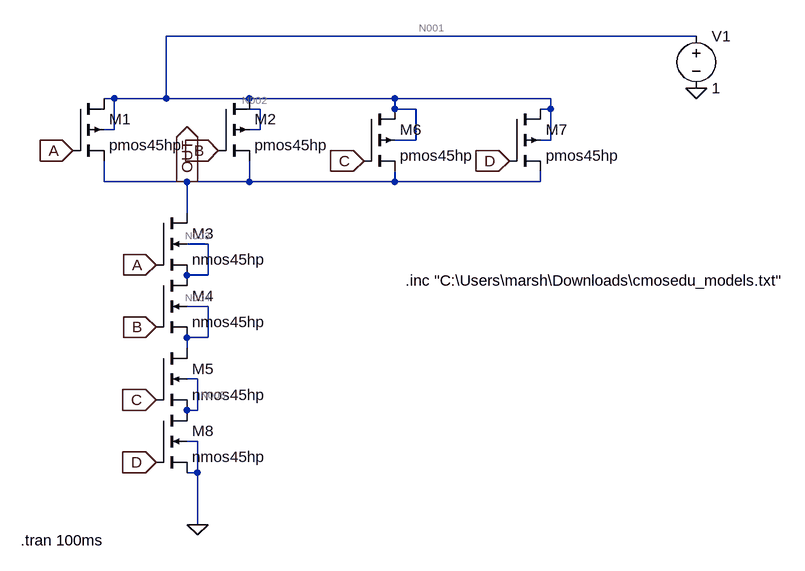
[diagram p0: schematic 4innand1.asc]
4innand1.asc, the LTspice schematic file:
Version 4.1
SHEET 1 1280 824
WIRE 1072 -32 256 -32
WIRE 176 64 160 64
WIRE 256 64 256 -32
WIRE 256 64 176 64
WIRE 384 64 256 64
WIRE 608 64 384 64
WIRE 848 64 608 64
WIRE 400 80 384 80
WIRE 608 80 608 64
WIRE 640 80 608 80
WIRE 848 80 848 64
WIRE 848 80 832 80
WIRE 176 112 176 64
WIRE 176 112 160 112
WIRE 400 112 400 80
WIRE 400 112 384 112
WIRE 640 128 640 80
WIRE 640 128 608 128
WIRE 848 128 848 80
WIRE 848 128 832 128
WIRE 160 192 160 160
WIRE 288 192 160 192
WIRE 384 192 384 160
WIRE 384 192 288 192
WIRE 608 192 608 176
WIRE 608 192 384 192
WIRE 832 192 832 176
WIRE 832 192 608 192
WIRE 288 240 288 192
WIRE 320 288 288 288
WIRE 320 336 320 288
WIRE 320 336 288 336
WIRE 320 384 288 384
WIRE 320 432 320 384
WIRE 320 432 288 432
WIRE 288 448 288 432
WIRE 304 496 288 496
WIRE 304 544 304 496
WIRE 304 544 288 544
WIRE 304 592 288 592
WIRE 304 640 304 592
WIRE 304 640 288 640
WIRE 304 720 304 640
FLAG 112 144 A
IOPIN 112 144 In
FLAG 240 320 A
IOPIN 240 320 In
FLAG 336 144 B
IOPIN 336 144 In
FLAG 240 416 B
IOPIN 240 416 In
FLAG 288 192 OUT
IOPIN 288 192 Out
FLAG 560 160 C
IOPIN 560 160 In
FLAG 240 528 C
IOPIN 240 528 In
FLAG 784 160 D
IOPIN 784 160 In
FLAG 240 624 D
IOPIN 240 624 In
FLAG 1072 48 0
FLAG 304 720 0
SYMBOL pmos4 112 64 R0
SYMATTR InstName M1
SYMATTR Value pmos45hp
SYMATTR Value2 l=100n w=300n
SYMBOL pmos4 336 64 R0
SYMATTR InstName M2
SYMATTR Value pmos45hp
SYMATTR Value2 l=100n w=300n
SYMBOL nmos4 240 240 R0
SYMATTR InstName M3
SYMATTR Value nmos45hp
SYMATTR Value2 l=100n w=800n
SYMBOL nmos4 240 336 R0
SYMATTR InstName M4
SYMATTR Value nmos45hp
SYMATTR Value2 l=100n w=800n
SYMBOL nmos4 240 448 R0
SYMATTR InstName M5
SYMATTR Value nmos45hp
SYMATTR Value2 l=100n w=800n
SYMBOL pmos4 560 80 R0
SYMATTR InstName M6
SYMATTR Value pmos45hp
SYMATTR Value2 l=100n w=300n
SYMBOL pmos4 784 80 R0
SYMATTR InstName M7
SYMATTR Value pmos45hp
SYMATTR Value2 l=100n w=300n
SYMBOL nmos4 240 544 R0
SYMATTR InstName M8
SYMATTR Value nmos45hp
SYMATTR Value2 l=100n w=800n
SYMBOL voltage 1072 -48 R0
WINDOW 123 0 0 Left 0
WINDOW 39 0 0 Left 0
SYMATTR InstName V1
SYMATTR Value 1
TEXT 624 344 Left 2 !.inc "C:\\Users\\marsh\\Downloads\\cmosedu_models.txt"
TEXT 32 744 Left 2 !.tran 100ms

The netlist it stands for:
* 4innand1.asc
M1 N001 A OUT N001 pmos45hp l=100n w=300n
M2 N001 B OUT N002 pmos45hp l=100n w=300n
M3 OUT A N003 N003 nmos45hp l=100n w=800n
M4 N003 B N004 N004 nmos45hp l=100n w=800n
M5 N004 C N005 N005 nmos45hp l=100n w=800n
M6 N001 C OUT N001 pmos45hp l=100n w=300n
M7 N001 D OUT N001 pmos45hp l=100n w=300n
M8 N005 D 0 0 nmos45hp l=100n w=800n
V1 N001 0 1
.model NMOS NMOS
.model PMOS PMOS
.lib standard.mos
.inc "C:\Users\marsh\Downloads\cmosedu_models.txt"
.tran 100ms
.backanno
.end

* Results of the author's LTspice run, read from the files saved beside the schematic
* Operating Point, zero values left out:
*   V(a) = 515.8 mV
*   V(b) = 505.8 mV
*   V(n002) = 871.6 mV
*   V(n004) = 43.44 mV
*   V(d) = 492.9 mV
*   V(n001) = 1 V
*   V(out) = 196.7 mV
*   V(n003) = 77.38 mV
*   V(c) = 499.2 mV
*   V(n005) = 19.45 mV
*   Id(M1) = 850.6 nA
*   Ig(M1) = -3.889 pA
*   Is(M1) = -850.6 nA
*   Id(M5) = 5.109 µA
*   Ig(M5) = 8.755 pA
*   Is(M5) = -5.109 µA
*   Id(M6) = 1.182 µA
*   Ig(M6) = -9.254 pA
*   Is(M6) = -1.182 µA
*   Id(M3) = 5.109 µA
*   Ig(M3) = 3.373 pA
*   Is(M3) = -5.109 µA
*   Id(M8) = 5.109 µA
*   Ig(M8) = 11.17 pA
*   Is(M8) = -5.109 µA
*   Id(M4) = 5.109 µA
*   Ig(M4) = 6.247 pA
*   Is(M4) = -5.109 µA
*   Id(M7) = 1.332 µA
*   Ig(M7) = -11.66 pA
*   Is(M7) = -1.332 µA
*   I(V1) = -5.109 µA
*   Id(M2) = 1.744 µA
*   Ig(M2) = -6.753 pA
*   Is(M2) = -1.744 µA